# EAGLE design Efm8Midi (EAGLE 9.0.0)
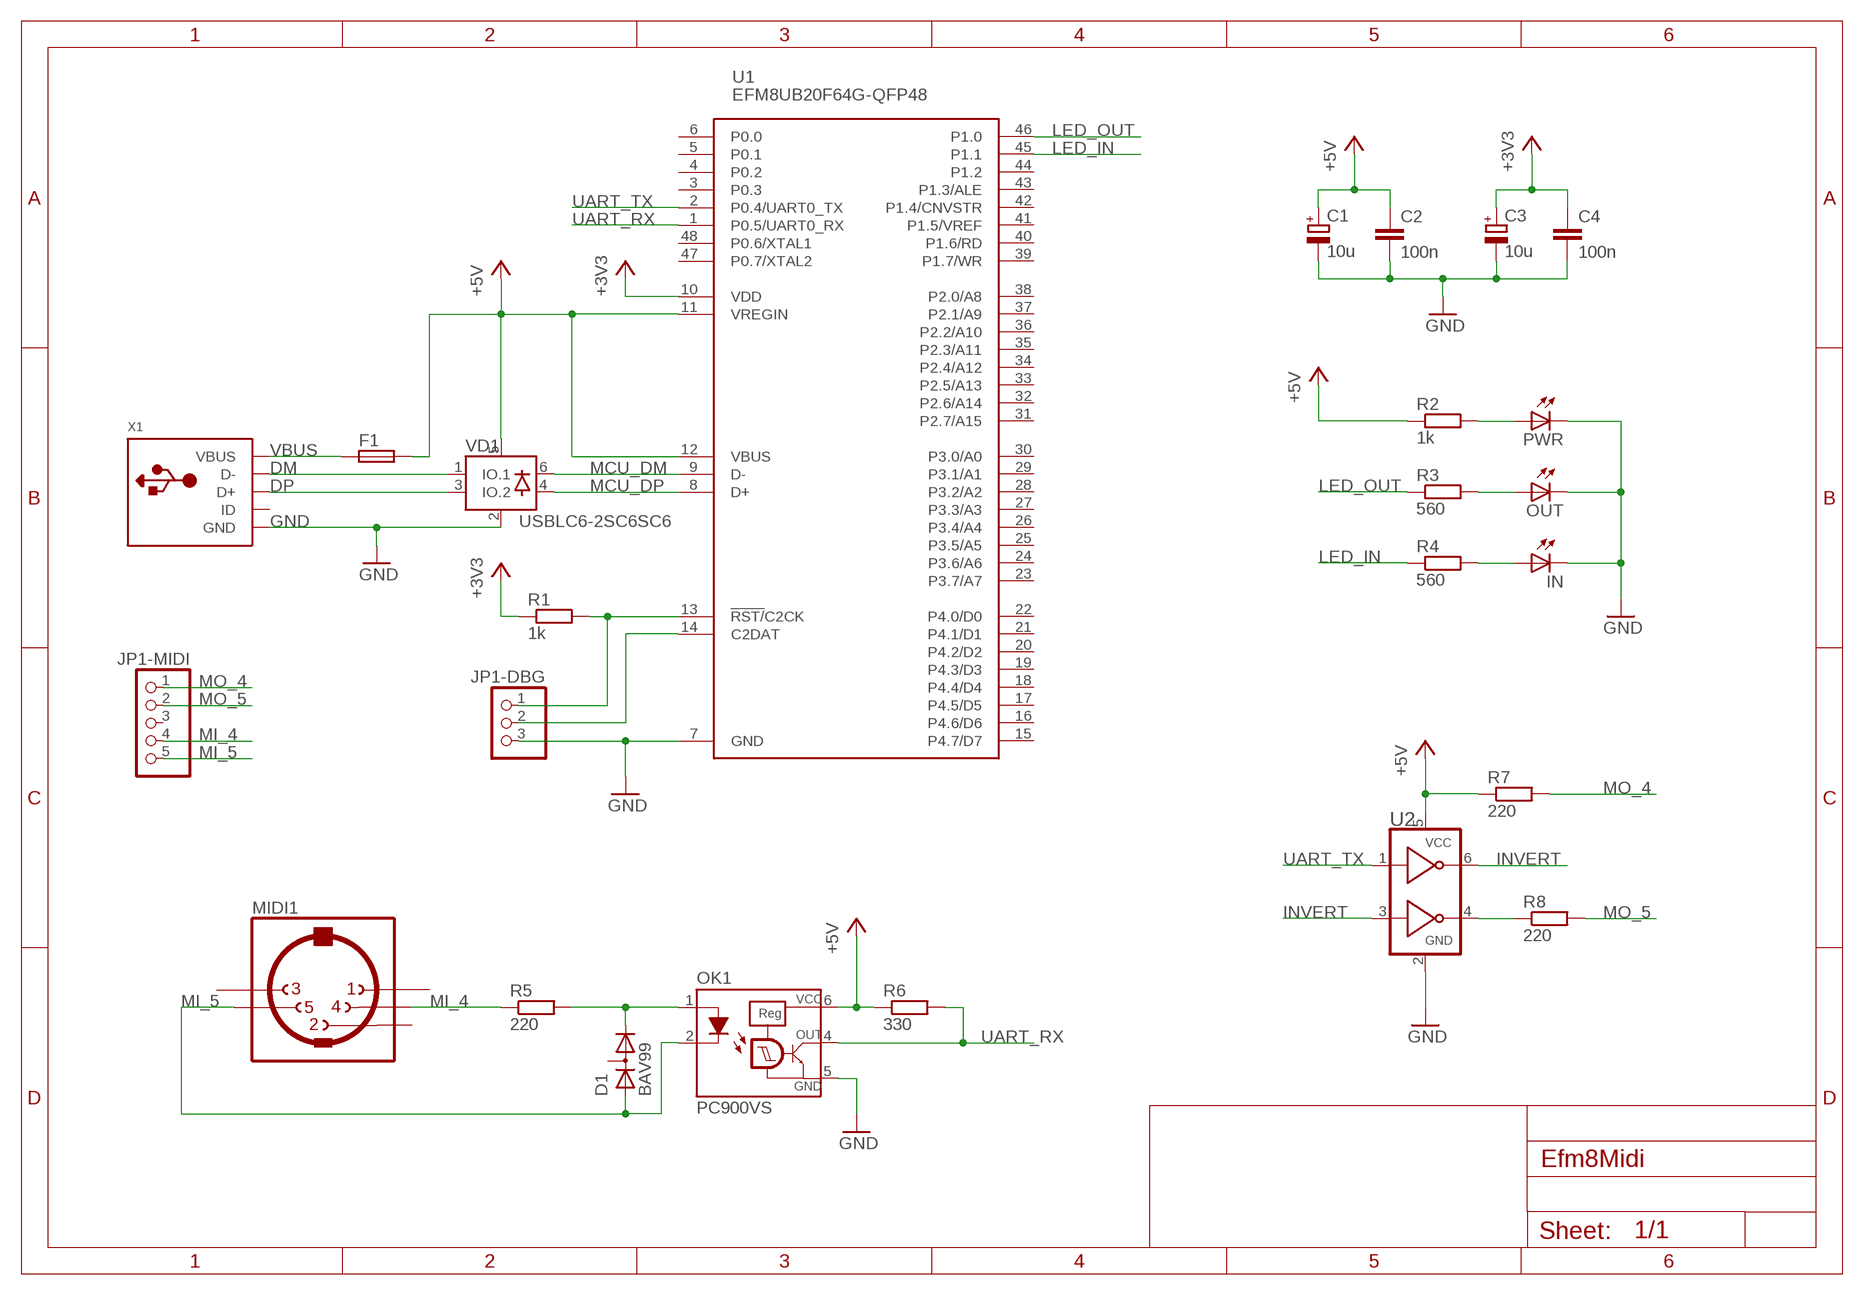
[diagram p0: schematic, sheet 1]

## Parts
C1  10u  CPOL-EUCT3216  [CT3216]
C2  100n  C-EUC1206  [C1206]
C3  10u  CPOL-EUCT3216  [CT3216]
C4  100n  C-EUC1206  [C1206]
D1  BAV99  [SOT23]
F1  MF-NSMF  [RCL-1206]
IN  LED3MM  [LED3MM]
JP1-DBG  PINHD-1X3  [1X03]
JP1-MIDI  PINHD-1X5  [1X05]
MIDI1  MIDIJACK  [MIDI-CP-2350]
OK1  PC900VS  [DIL6-SMD]
OUT  LED3MM  [LED3MM]
PWR  LED3MM  [LED3MM]
R1  1k  R-EU_R0805  [R0805]
R2  1k  R-EU_R0805  [R0805]
R3  560  R-EU_R0805  [R0805]
R4  560  R-EU_R0805  [R0805]
R5  220  R-EU_R0805  [R0805]
R6  330  R-EU_R0805  [R0805]
R7  220  R-EU_R0805  [R0805]
R8  220  R-EU_R0805  [R0805]
U1  EFM8UB20F64G-QFP48  [QFP48-7X7-0P5MM]
U2  74LVC2G04SOT-23-6-DBV  [SOT-23-290X160-DBV]
VD1  USBLC6-2SC6SC6  [SOT-23-6L]
X1  MINI-USB-B32005-301  [USB-MINI-B]

## Nets
+3V3: C3.+ C4.1 R1.1 U1.10(VDD)
+5V: C1.+ C2.1 F1.2 OK1.6(VCC) R2.1 R6.1 R7.1 U1.11(VREGIN) U1.12(VBUS) U2.5(VCC) VD1.5(VBUS)
DM: VD1.1(IO.1) X1.D-
DP: VD1.3(IO.2) X1.D+
GND: C1.- C2.2 C3.- C4.2 IN.K(C) JP1-DBG.3 OK1.5(GND) OUT.K(C) PWR.K(C) U1.7(GND) U2.2(GND) VD1.2(GND) X1.GND
INVERT: U2.3(A2) U2.6(Y1)
LED_IN: R4.1 U1.45(P1.1)
LED_OUT: R3.1 U1.46(P1.0)
MCU_DM: U1.9(D-) VD1.6(IO_1)
MCU_DP: U1.8(D+) VD1.4(IO_2)
MI_4: JP1-MIDI.4 MIDI1.4 R5.1
MI_5: D1.1(A) JP1-MIDI.5 MIDI1.5 OK1.2(C)
MO_4: JP1-MIDI.1 R7.2
MO_5: JP1-MIDI.2 R8.2
N$1: IN.A R4.2
N$2: JP1-DBG.1 R1.2 U1.13(!RST/!C2CK)
N$3: PWR.A R2.2
N$7: R8.1 U2.4(Y2)
N$10: D1.2(C) OK1.1(A) R5.2
N$11: JP1-DBG.2 U1.14(C2DAT)
N$21: OUT.A R3.2
UART_RX: OK1.4(OUT) R6.2 U1.1(P0.5/UART0_RX)
UART_TX: U1.2(P0.4/UART0_TX) U2.1(A1)
VBUS: F1.1 X1.VBUS
Unconnected: D1.3(AC) JP1-MIDI.3 MIDI1.1 MIDI1.2 MIDI1.3 MIDI1.PE.0(MIDI-TEETH) MIDI1.PE.1(MIDI-TEETH) U1.3(P0.3) U1.4(P0.2) U1.5(P0.1) U1.6(P0.0) U1.15(P4.7/D7) U1.16(P4.6/D6) U1.17(P4.5/D5) U1.18(P4.4/D4) U1.19(P4.3/D3) U1.20(P4.2/D2) U1.21(P4.1/D1) U1.22(P4.0/D0) U1.23(P3.7/A7) U1.24(P3.6/A6) U1.25(P3.5/A5) U1.26(P3.4/A4) U1.27(P3.3/A3) U1.28(P3.2/A2) U1.29(P3.1/A1) U1.30(P3.0/A0) U1.31(P2.7/A15) U1.32(P2.6/A14) U1.33(P2.5/A13) U1.34(P2.4/A12) U1.35(P2.3/A11) U1.36(P2.2/A10) U1.37(P2.1/A9) U1.38(P2.0/A8) U1.39(P1.7/WR) U1.40(P1.6/RD) U1.41(P1.5/VREF) U1.42(P1.4/CNVSTR) U1.43(P1.3/ALE) U1.44(P1.2) U1.47(P0.7/XTAL2) U1.48(P0.6/XTAL1) X1.ID

## Library data of the parts
C1 C3 = rcl:CPOL-EU: POLARIZED CAPACITOR, European symbol; SPICEPREFIX: C
C2 C4 = rcl:C-EU: CAPACITOR, European symbol; SPICEPREFIX: C
D1 = EFM8Midi:BAV99: Small Signal Switching Diode, Dual in Series Fast switching speed Non repetitive peak reverse voltage: 100V Average forward current: 150mA Forward voltage: 0.85V @ 10mA Reverse recovery time: 6ns
F1 = EFM8Midi:MF-NSMF: Bourns MF-NSMF Series - PRC Resettable Fuses USB port protection - USB 2.0, 3.0 HDMI 1.4 Source protection PC motherboards - Plug and Play protection Mobile phones - Battery and port protection PDAs / digital cameras
IN OUT PWR = led:LED: LED OSRAM: - CHIPLED LG R971, LG N971, LY N971, LG Q971, LY Q971, LO R971, LY R971 LH N974, LH R974 LS Q976, LO Q976, LY Q976 LO Q996 - Hyper CHIPLED LW Q18S LB Q993, LB Q99A, LB R99A - SideLED LS A670, LO A670, LY A670, LG A670, LP A670 LB A673, LV A673, LT A673, LW A673 LH A674 LY A675 LS A676, LA A676, LO A676, LY A676, LW A676 LS A679, LY A679, LG A679 - Hyper Micro SIDELED® LS Y876, LA Y876, LO Y876, LY Y876 LT Y87S - SmartLED LW L88C, LW L88S LB L89C, LB L89S, LG L890 LS L89K, LO L89K, LY L89K LS L896, LA L896, LO L896, LY L896 - TOPLED LS T670, LO T670, LY T670, LG T670, LP T670 LSG T670, LSP T670, LSY T670, LOP T670, LYG T670 LG T671, LOG T671, LSG T671 LB T673, LV T673, LT T673, LW T673 LH T674 LS T676, LA T676, LO T676, LY T676, LB T676, LH T676, LSB T676, LW T676 LB T67C, LV T67C, LT T67C, LS T67K, LO T67K, LY T67K, LW E67C LS E67B, LA E67B, LO E67B, LY E67B, LB E67C, LV E67C, LT E67C LW T67C LS T679, LY T679, LG T679 LS T770, LO T770, LY T770, LG T770, LP T770 LB T773, LV T773, LT T773, LW T773 LH T774 LS E675, LA E675, LY E675, LS T675 LS T776, LA T776, LO T776, LY T776, LB T776 LHGB T686 LT T68C, LB T68C - Hyper Mini TOPLED® LB M676 - Mini TOPLED Santana® LG M470 LS M47K, LO M47K, LY M47K Source: http://www.osram.convergy.de LUXEON: - LUMILED® LXK2-PW12-R00, LXK2-PW12-S00, LXK2-PW14-U00, LXK2-PW14-V00 LXK2-PM12-R00, LXK2-PM12-S00, LXK2-PM14-U00 LXK2-PE12-Q00, LXK2-PE12-R00, LXK2-PE12-S00, LXK2-PE14-T00, LXK2-PE14-U00 LXK2-PB12-K00, LXK2-PB12-L00, LXK2-PB12-M00, LXK2-PB14-N00, LXK2-PB14-P00, LXK2-PB14-Q00 LXK2-PR12-L00, LXK2-PR12-M00, LXK2-PR14-Q00, LXK2-PR14-R00 LXK2-PD12-Q00, LXK2-PD12-R00, LXK2-PD12-S00 LXK2-PH12-R00, LXK2-PH12-S00 LXK2-PL12-P00, LXK2-PL12-Q00, LXK2-PL12-R00 Source: www.luxeon.com KINGBRIGHT: KA-3528ASYC Source: www.kingbright.com
JP1-DBG = pinhead:PINHD-1X3: PIN HEADER
JP1-MIDI = pinhead:PINHD-1X5: PIN HEADER
MIDI1 = EFM8Midi:MIDIJACK: DIN 5 jack also known as MIDI jack A modification of conn-hirshman:MAB5SH with two options for the grounding 'teeth'
OK1 = EFM8Midi:PC900V: 6-Pin Optocoupler Digital Output, Normal OFF Operation DIP 6 pin Photocoupler Features 6 pin DIP & SMT package Double transfer mold package Normal OFF operation, open collector output TTL and LSTTL compatible output, supply voltage (VCC : 3 to 15 V) Rise time: 0.5us, Fall time: 0.5us (max)
R1-R8 = rcl:R-EU_: RESISTOR, European symbol; SPICEPREFIX: R
U1 = EFM8Midi:EFM8UB20F64G-QFP48: EFM8UB2 - is a multi-purpose 8-bit MCU with USB feature set. <http://www.silabs.com/Support%20Documents/TechnicalDocs/efm8ub2-datasheet.pdf> CPU: 8051 @48MHz, 32 or 64 kB Flash, 2 or 4 kB RAM Communication: SPI, 2 SMBus/I2C, 2 UART, EMIF, USB 2.0 FullSpeed, 10-bit ADC, 40 I/O ports Package: QFP48 7x7mm, 5V tolerant.; MFG: Silicon Laboratories; PACKAGE: QFP-48
U2 = EFM8Midi:74LVC2G04: Dual Inverter Supports 5 V operation Inputs accept voltages to 5.5 V ±24 mA output drive at 3.3 V ESD Protection Max tpd of 4.1ns at 3.3 V
VD1 = EFM8Midi:USBLC6-2SC6: VERY LOW CAPACITANCE ESD PROTECTION 2 line 2 data-line protection Protects VBUS Very low capacitance: 3.5 pF max. Very low leakage current: 150 nA max Datasheet link <http://www.st.com/web/catalog/sense_power/FM114/CL1137/SC1489/PF93353>
X1 = EFM8Midi:MINI-USB-B: MINI USB-B Conector Type B Connector, 5-PIN Based on "con-cypressindustries"; OC_FARNELL: unknown; OC_NEWARK: unknown

## Board
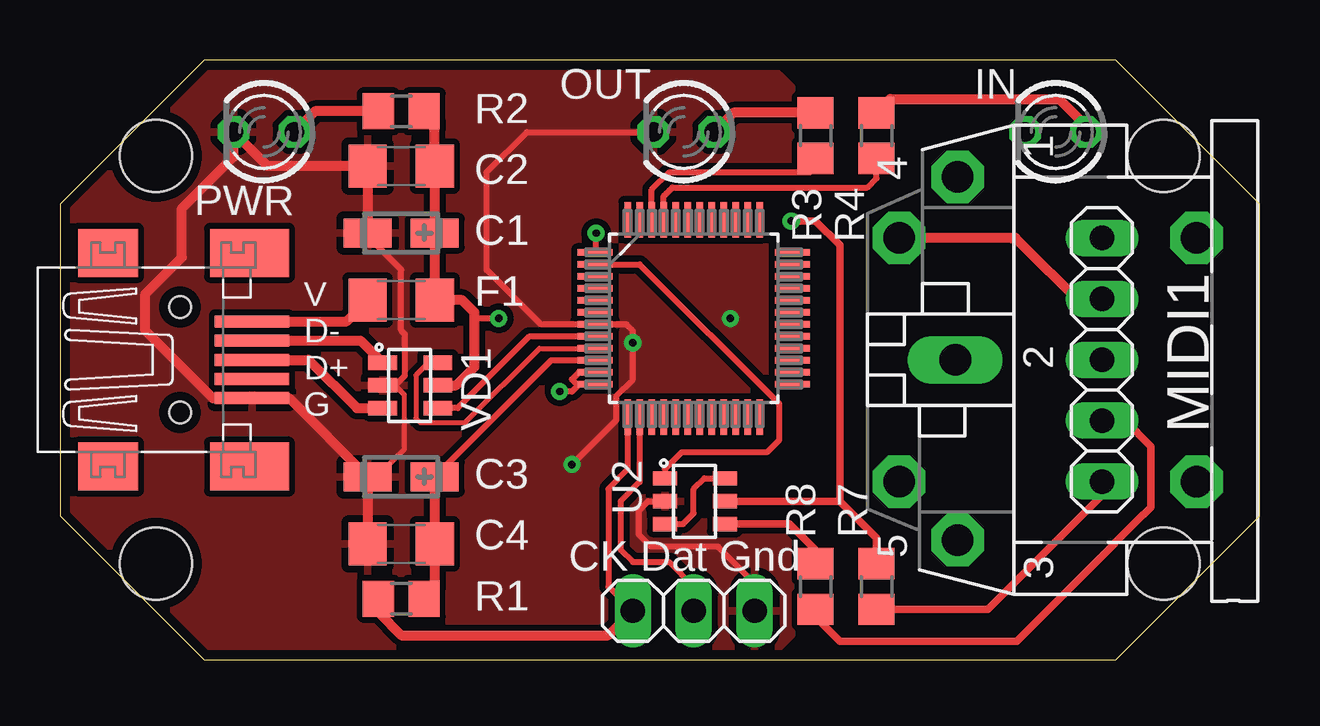
[diagram p1: board, top side]
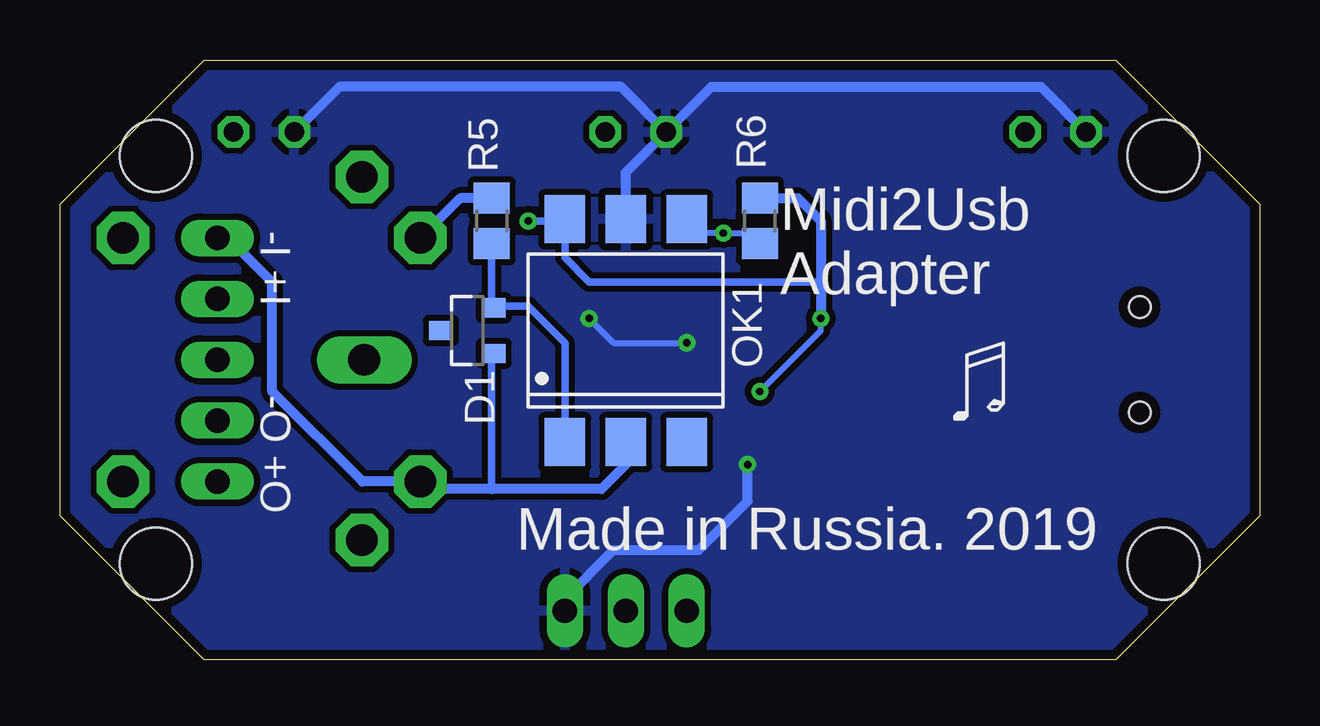
[diagram p2: board, bottom side, seen from below]

Size 50 x 25 mm. Coordinates in mm from the lower left corner, seen from the top.
Outline: 6,0 44,0 50,6 50,19 44,25 6,25 0,19 0,6 6,0
Copper layers (1*16): Top 0.035mm / dielectric 1.5mm / Bottom 0.035mm
Design rules "default *": minimum track width 8mil, minimum drill 0.3mm, track to track 8mil, track to pad 8mil, pad to pad 8mil, via to via 10mil, smd to smd 8mil, copper to edge 16mil, drill to drill 8mil, minimum pad ring 10mil, minimum via ring 8mil, stop-mask expansion 4mil, vias tented up to drill 12mil, thermal gap 12mil
Holes 3 mm at 4,21 4,4 46,21 46,4

### Footprints (pad centres in the part's own frame; a part is rotated, then mirrored left to right if it is on the bottom)
CT3216 = smd 2 x 1.2: + -1.4,0; - 1.4,0
C1206 = smd 1.6 x 1.8: 1 -1.4,0; 2 1.4,0
SOT23 = smd 0.8 x 1: 1 -0.95,-1.1; 2 0.95,-1.1; 3 0,1.1
RCL-1206 = smd 1.6 x 1.8: 1 -1.4,0; 2 1.4,0
LED3MM = drill 0.813 octagon: A -1.27,0; K 1.27,0
1X03 = drill 1.016 long: 1 -2.54,0; 2 0,0; 3 2.54,0
1X05 = drill 1.016 long: 1 -5.08,0; 2 -2.54,0; 3 0,0; 4 2.54,0; 5 5.08,0
MIDI-CP-2350 = drill 1.321 pad 2.184 octagon: 1 7.62,12.58; 3 -7.52,12.58; 4 5.08,15.02; 5 -5.08,15.02; PE.0 -5.08,2.62; PE.1 5.08,2.62 | drill 1.321 long: 2 0,12.68
DIL6-SMD = smd 1.7 x 2: 1 -2.54,-4.645; 2 0,-4.645; 3 2.54,-4.645; 4 2.54,4.645; 5 0,4.645; 6 -2.54,4.645
R0805 = smd 1.3 x 1.5: 1 -0.95,0; 2 0.95,0
QFP48-7X7-0P5MM = smd 1.473 x 0.279: 1 -4.115,2.75; 2 -4.115,2.25; 3 -4.115,1.75; 4 -4.115,1.25; 5 -4.115,0.75; 6 -4.115,0.25; 7 -4.115,-0.25; 8 -4.115,-0.75; 9 -4.115,-1.25; 10 -4.115,-1.75; 11 -4.115,-2.25; 12 -4.115,-2.75; 25 4.115,-2.75; 26 4.115,-2.25; 27 4.115,-1.75; 28 4.115,-1.25; 29 4.115,-0.75; 30 4.115,-0.25; 31 4.115,0.25; 32 4.115,0.75; 33 4.115,1.25; 34 4.115,1.75; 35 4.115,2.25; 36 4.115,2.75 | smd 0.279 x 1.473: 13 -2.75,-4.115; 14 -2.25,-4.115; 15 -1.75,-4.115; 16 -1.25,-4.115; 17 -0.75,-4.115; 18 -0.25,-4.115; 19 0.25,-4.115; 20 0.75,-4.115; 21 1.25,-4.115; 22 1.75,-4.115; 23 2.25,-4.115; 24 2.75,-4.115; 37 2.75,4.115; 38 2.25,4.115; 39 1.75,4.115; 40 1.25,4.115; 41 0.75,4.115; 42 0.25,4.115; 43 -0.25,4.115; 44 -0.75,4.115; 45 -1.25,4.115; 46 -1.75,4.115; 47 -2.25,4.115; 48 -2.75,4.115
SOT-23-290X160-DBV = smd 0.6 x 1: 1 -0.95,-1.2; 2 0,-1.2; 3 0.95,-1.2; 4 0.95,1.3; 5 0,1.3; 6 -0.95,1.3
SOT-23-6L = smd 0.6 x 1.2: 1 -0.95,-2.3; 2 0,-2.3; 3 0.95,-2.3; 4 0.95,0; 5 0,0; 6 -0.95,0
USB-MINI-B = smd 3.1 x 0.5: D+ 3,0; D- 3,0.8; GND 3,-1.6; ID 3,-0.8; VBUS 3,1.6 | smd 2.5 x 2: M1 -3,-4.45; M2 -3,4.45 | smd 3.3 x 2: M3 2.9,4.45; M4 2.9,-4.45 | hole 0.9: 0,2.2; 0,-2.2

### Placement (x,y rotation side)
C1  14.22,17.78 180 top
C2  14.22,20.57 180 top
C3  14.22,7.62 180 top
C4  14.22,4.83 180 top
D1  33.02,13.72 90 bottom
F1  14.22,14.99 0 top
IN  41.5,22 180 top
JP1-DBG  26.42,2.03 0 top
JP1-MIDI  43.43,12.5 90 top
MIDI1  50,12.5 90 top
OK1  26.42,13.72 0 bottom
OUT  26,22 180 top
PWR  8.5,22 180 top
R1  14.22,2.54 180 top
R2  14.22,22.86 180 top
R3  31.5,21.84 90 top
R4  34.04,21.84 90 top
R5  32,18.29 270 bottom
R6  20.83,18.29 270 bottom
R7  34.04,3.05 270 top
R8  31.5,3.05 270 top
U1  26.42,14.22 0 top
U2  26.42,6.6 270 top
VD1  15.75,11.43 270 top
X1  5,12.5 0 top

### Tracks (layer width: path | path; a pad name or v marks a point on that pad's centre or on a via)
+3V3
  Top 0.254: U1.10 20.48,12.47 C3.+
  Top 0.406: C3.+ C4.1 15.62,2.99 R1.1
+5V  (via drill 0.3)
  Top 0.254: v18.29,14.22 17.27,14.22 | U1.12 21.63,11.47 21.59,11.43 | 21.59,11.43 21.34,11.18 v20.83,11.18 | U1.11 21.63,11.97 21.34,11.68 21.59,11.43
  Top 0.305: 32.51,6.6 34.04,5.08 R7.1 | U2.5 32.51,6.6 | 32.51,6.6 32.51,17.27 31.5,18.29 v30.48,18.29
  Top 0.406: R2.1 15.62,22.41 C2.1 C1.+ F1.2 16.76,14.99 17.27,14.48 17.27,14.22 17.27,12.19 16.51,11.43 VD1.5
  Bottom 0.254: v20.83,11.18 18.29,13.72 v18.29,14.22
  Bottom 0.305: v30.48,18.29 29.03,18.29 OK1.6 28.96,16.76 27.94,15.75 18.29,15.75
  Bottom 0.406: R6.1 19.24,19.24 18.29,18.29 18.29,15.75 v18.29,14.22
DM
  Top 0.406: X1.D- 12.53,13.3 VD1.1
DP
  Top 0.406: X1.D+ 10.36,12.5 12.38,10.48 VD1.3
GND  (via drill 0.3)
  Top 0.203: 13.97,11.43 14.35,11.05 14.35,8.77 13.21,7.62 C3.-
  Top 0.254: JP1-DBG.3 28.96,3.17 27.43,4.7 24.64,4.7 24.13,5.21 24.13,6.22 24.51,6.6 U2.2 | OUT.K 19.46,22 17.78,20.32 17.78,16.26 20.06,13.97 U1.7 23.62,13.97 23.88,13.72 v23.88,13.21 23.88,11.66 23.2,10.98 23.2,9.99 v21.34,8.13 | VD1.2 13.97,11.43 14.38,11.84 14.38,13.56 14.22,13.72 14.22,16.26 12.82,17.66 C1.-
  Top 0.406: C1.- C2.2 8.66,20.57 7.25,21.98 | C4.2 C3.- 9.54,10.9 X1.GND 6.37,10.9 3.56,13.72 3.56,15.24 5.08,16.76 5.08,18.8 7.25,20.96 7.25,21.98 | 7.25,21.98 PWR.K
  Bottom 0.254: v27.94,14.22 26.92,13.21 v23.88,13.21
  Bottom 0.406: OUT.K 22.86,23.87 22.86,23.88 9.11,23.88 PWR.K | OUT.K 26.61,23.88 38.35,23.88 IN.K | OK1.5 26.42,20.31 OUT.K | JP1-DBG.3 28.96,2.54 26.92,4.57 23.37,4.57 21.34,6.6 v21.34,8.13
  pour Top (isolate 0.254): 0,18.8 0,6.1 6.1,0 29.46,0 30.48,1.02 30.48,23.88 29.46,24.89 6.1,24.89
  pour Bottom (isolate 0.254): 49.78,18.8 49.78,5.59 44.2,0 6.1,0 0,6.1 0,18.8 6.1,24.89 44.2,24.89 49.78,19.3
INVERT
  Top 0.254: U2.3 25.97,5.65 26.42,6.1 26.42,7.11 26.86,7.55 U2.6
LED_IN
  Top 0.254: U1.45 25.17,19.32 25.27,19.43 25.4,19.56 25.53,19.68 33.66,19.68 34.04,20.07 R4.1
LED_OUT
  Top 0.254: U1.46 24.67,19.59 25.4,20.32 31.24,20.32 31.5,20.57 R3.1
MCU_DM
  Top 0.203: VD1.6 15.37,12.38 14.84,11.86 14.84,10.05 15.02,9.88 16.89,9.88 19.99,12.97 U1.9
MCU_DP
  Top 0.254: U1.8 19.56,13.46 16.58,10.48 VD1.4
MI_4
  Top 0.406: 43.38,15.04 JP1-MIDI.4 43.13,14.73 42.67,14.73 39.82,17.58 39.62,17.58 MIDI1.4
  Bottom 0.406: R5.1 33.32,19.24 MIDI1.4
MI_5
  Bottom 0.305: D1.1 32,12.68 32,7.11
  Bottom 0.406: JP1-MIDI.5 42.98,17.58 41.15,15.75 41.15,11.18 37.39,7.42 MIDI1.5 34.67,7.11 32,7.11 27.43,7.11 26.42,8.13 OK1.2
MO_4
  Top 0.305: R7.2 38.68,2.1 43.43,6.85 JP1-MIDI.1
MO_5
  Top 0.305: R8.2 31.5,1.78 32.51,0.76 39.88,0.76 43.94,4.83 43.94,4.85 45.15,6.06 45.17,6.06 45.47,6.35 45.47,8.89 44.4,9.96 JP1-MIDI.2
N$1
  Top 0.406: R4.2 34.61,23.37 41.66,23.37 42.77,22.25 IN.A
N$2
  Top 0.254: U1.13 23.67,7.92 22.86,7.11 22.86,3.05 JP1-DBG.1
  Top 0.406: R1.2 13.27,1.97 14.22,1.02 22.86,1.02 JP1-DBG.1
N$3
  Top 0.406: PWR.A 10.63,22.86 R2.2
N$7
  Top 0.305: U2.4 30.41,5.65 31.5,4.57 R8.1
N$10
  Bottom 0.305: R5.2 32,14.75 D1.2 31.85,14.73 30.48,14.73 28.96,13.21 OK1.1
N$11
  Top 0.254: U1.14 24.17,7.4 23.37,6.6 23.37,4.57 23.88,4.06 25.4,4.06 26.42,3.05 JP1-DBG.2
N$21
  Top 0.406: OUT.A 27.56,22.29 28.06,22.79 R3.2
UART_RX  (via drill 0.3)
  Top 0.254: U1.1 22.35,17.02 v22.35,17.78
  Bottom 0.254: R6.2 21.27,17.78 v22.35,17.78 23.3,17.78 OK1.4
UART_TX
  Top 0.254: U1.2 24.17,16.47 29.97,10.67 29.97,9.14 29.46,8.64 25.91,8.64 25.22,7.94 U2.1
VBUS
  Top 0.406: X1.VBUS 11.94,14.1 F1.1

### Text on the board
tNames: V / D- / D+ / G | CK Dat Gnd
bNames: I+ I- | O+ O- | Midi2Usb / Adapter / / / / Made in Russia. 2019